# EAGLE schematic TeamB_PDS (EAGLE 7.1.0)
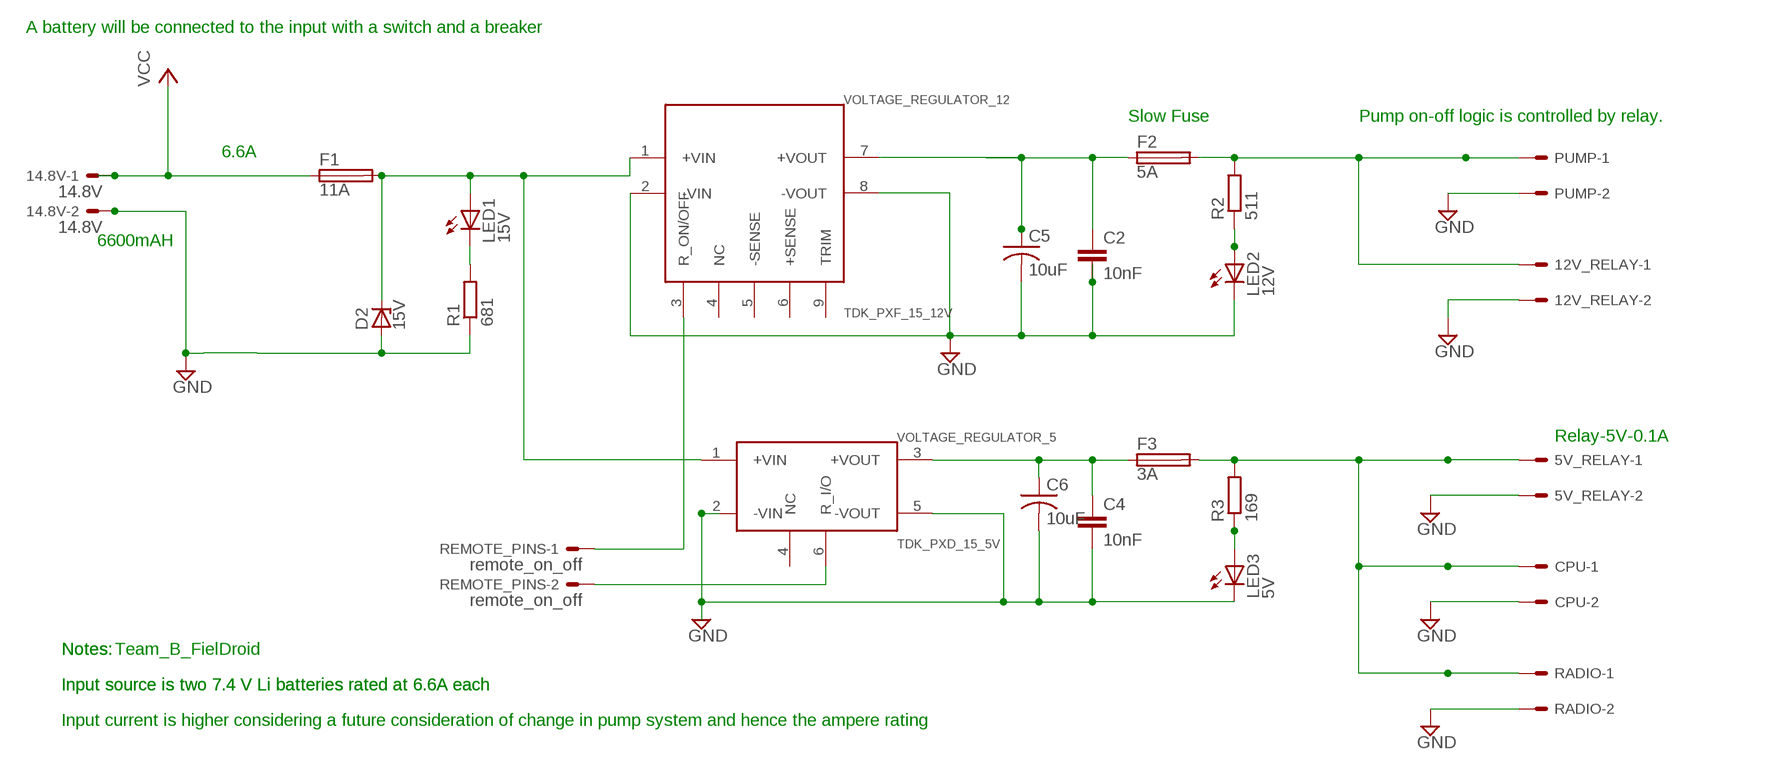
[diagram p0: schematic, sheet 1]

## Parts
5V_RELAY  5566-2  [5566-2]
12V_RELAY  5566-2  [5566-2]
14.8V  14.8V  5566-2  [5566-2]
C2  10nF  C2.5/4  [C2.5-4]
C4  10nF  C2.5/4  [C2.5-4]
C5  10uF  C-US050-024X044  [C050-024X044]
C6  10uF  C-US050-024X044  [C050-024X044]
CPU  5566-2  [5566-2]
D2  15V  ZENER-DIODEZD-5  [ZDIO-5]
F1  11A  FUSEBLANK_5X20MM  [FUSE_HOLDER_5X20MM]
F2  5A  FUSEBLANK_5X20MM  [FUSE_HOLDER_5X20MM]
F3  3A  FUSEBLANK_5X20MM  [FUSE_HOLDER_5X20MM]
LED1  15V  LED5MM  [LED5MM]
LED2  12V  LED5MM  [LED5MM]
LED3  5V  LED5MM  [LED5MM]
PUMP  5566-2  [5566-2]
R1  681  R-EU_0204/7  [0204/7]
R2  511  R-EU_0204/7  [0204/7]
R3  169  R-EU_0204/7  [0204/7]
RADIO  5566-2  [5566-2]
REMOTE_PINS  remote_on_off  5566-2  [5566-2]
VOLTAGE_REGULATOR_5  TDK_PXD_15_5V  [TDK-PXD_15-5V]
VOLTAGE_REGULATOR_12  TDK_PXF_15_12V  [TDK_PXF_15_12V]

## Nets
GND: 5V_RELAY.2 12V_RELAY.2 14.8V.2 C2.2 C4.2 C5.2 C6.2 CPU.2 D2.A LED2.K(C) LED3.K(C) PUMP.2 R1.1 RADIO.2 VOLTAGE_REGULATOR_5.2(-VIN) VOLTAGE_REGULATOR_5.5(-VOUT) VOLTAGE_REGULATOR_12.2(-VIN) VOLTAGE_REGULATOR_12.8(-VOUT)
N$1: LED1.K(C) R1.2
N$2: C4.1 C6.1 F3.1 VOLTAGE_REGULATOR_5.3(+VOUT)
N$3: D2.C F1.2 LED1.A VOLTAGE_REGULATOR_5.1(+VIN) VOLTAGE_REGULATOR_12.1(+VIN)
N$4: C2.1 C5.1 F2.1 VOLTAGE_REGULATOR_12.7(+VOUT)
N$5: LED2.A R2.1
N$6: REMOTE_PINS.1 VOLTAGE_REGULATOR_12.3(R_ON/OFF)
N$7: REMOTE_PINS.2 VOLTAGE_REGULATOR_5.6(R_I/O)
N$10: 5V_RELAY.1 CPU.1 F3.2 R3.2 RADIO.1
N$11: LED3.A R3.1
RELAY_12V,0.1A: 12V_RELAY.1 F2.2 PUMP.1 R2.2
VCC,14.8V,6.6A: 14.8V.1 F1.1 ; supply symbol labelled VCC
Unconnected: VOLTAGE_REGULATOR_5.4(NC) VOLTAGE_REGULATOR_12.4(NC) VOLTAGE_REGULATOR_12.5(-SENSE) VOLTAGE_REGULATOR_12.6(+SENSE) VOLTAGE_REGULATOR_12.9(TRIM)

## Notes on the sheet
- A battery will be connected to the input with a switch and a breaker
- Slow Fuse | Pump on-off logic is controlled by relay.
- 6.6A
- 6600mAH
- Relay-5V-0.1A
- Notes: | Notes: | Team_B_FielDroid
- Input source is two 7.4 V Li batteries rated at 6.6A each | Input source is two 7.4 V Li batteries rated at 6.6A each
- Input current is higher considering a future consideration of change in pump system and hence the ampere rating

## Library data of the parts
5V_RELAY 12V_RELAY 14.8V CPU PUMP RADIO REMOTE_PINS = con-molex:5566-2: Mini FIT connector 2 pol Source: http://www.molex.com; OC_FARNELL: 1822072; OC_NEWARK: unknown
C2 C4 = capacitor-wima:C: CAPACITOR naming: grid - package width
C5 C6 = rcl:C-US: CAPACITOR, American symbol
D2 = diode:ZENER-DIODE: Z-Diode
F1-F3 = fuse:FUSE: Fuse; OC_FARNELL: unknown; OC_NEWARK: unknown
LED1-LED3 = led:LED: LED OSRAM: - CHIPLED LG R971, LG N971, LY N971, LG Q971, LY Q971, LO R971, LY R971 LH N974, LH R974 LS Q976, LO Q976, LY Q976 LO Q996 - Hyper CHIPLED LW Q18S LB Q993, LB Q99A, LB R99A - SideLED LS A670, LO A670, LY A670, LG A670, LP A670 LB A673, LV A673, LT A673, LW A673 LH A674 LY A675 LS A676, LA A676, LO A676, LY A676, LW A676 LS A679, LY A679, LG A679 - Hyper Micro SIDELED® LS Y876, LA Y876, LO Y876, LY Y876 LT Y87S - SmartLED LW L88C, LW L88S LB L89C, LB L89S, LG L890 LS L89K, LO L89K, LY L89K LS L896, LA L896, LO L896, LY L896 - TOPLED LS T670, LO T670, LY T670, LG T670, LP T670 LSG T670, LSP T670, LSY T670, LOP T670, LYG T670 LG T671, LOG T671, LSG T671 LB T673, LV T673, LT T673, LW T673 LH T674 LS T676, LA T676, LO T676, LY T676, LB T676, LH T676, LSB T676, LW T676 LB T67C, LV T67C, LT T67C, LS T67K, LO T67K, LY T67K, LW E67C LS E67B, LA E67B, LO E67B, LY E67B, LB E67C, LV E67C, LT E67C LW T67C LS T679, LY T679, LG T679 LS T770, LO T770, LY T770, LG T770, LP T770 LB T773, LV T773, LT T773, LW T773 LH T774 LS E675, LA E675, LY E675, LS T675 LS T776, LA T776, LO T776, LY T776, LB T776 LHGB T686 LT T68C, LB T68C - Hyper Mini TOPLED® LB M676 - Mini TOPLED Santana® LG M470 LS M47K, LO M47K, LY M47K Source: http://www.osram.convergy.de LUXEON: - LUMILED® LXK2-PW12-R00, LXK2-PW12-S00, LXK2-PW14-U00, LXK2-PW14-V00 LXK2-PM12-R00, LXK2-PM12-S00, LXK2-PM14-U00 LXK2-PE12-Q00, LXK2-PE12-R00, LXK2-PE12-S00, LXK2-PE14-T00, LXK2-PE14-U00 LXK2-PB12-K00, LXK2-PB12-L00, LXK2-PB12-M00, LXK2-PB14-N00, LXK2-PB14-P00, LXK2-PB14-Q00 LXK2-PR12-L00, LXK2-PR12-M00, LXK2-PR14-Q00, LXK2-PR14-R00 LXK2-PD12-Q00, LXK2-PD12-R00, LXK2-PD12-S00 LXK2-PH12-R00, LXK2-PH12-S00 LXK2-PL12-P00, LXK2-PL12-Q00, LXK2-PL12-R00 Source: www.luxeon.com KINGBRIGHT: KA-3528ASYC Source: www.kingbright.com
R1-R3 = rcl:R-EU_: RESISTOR, European symbol
VOLTAGE_REGULATOR_5 = TeamB_Task11:TDK_PXD_15_5V
VOLTAGE_REGULATOR_12 = TeamB_Task11:TDK_PXF_15_12V